# Altium project aakatz ESE 6710  Coil Interface Board.PrjPcb
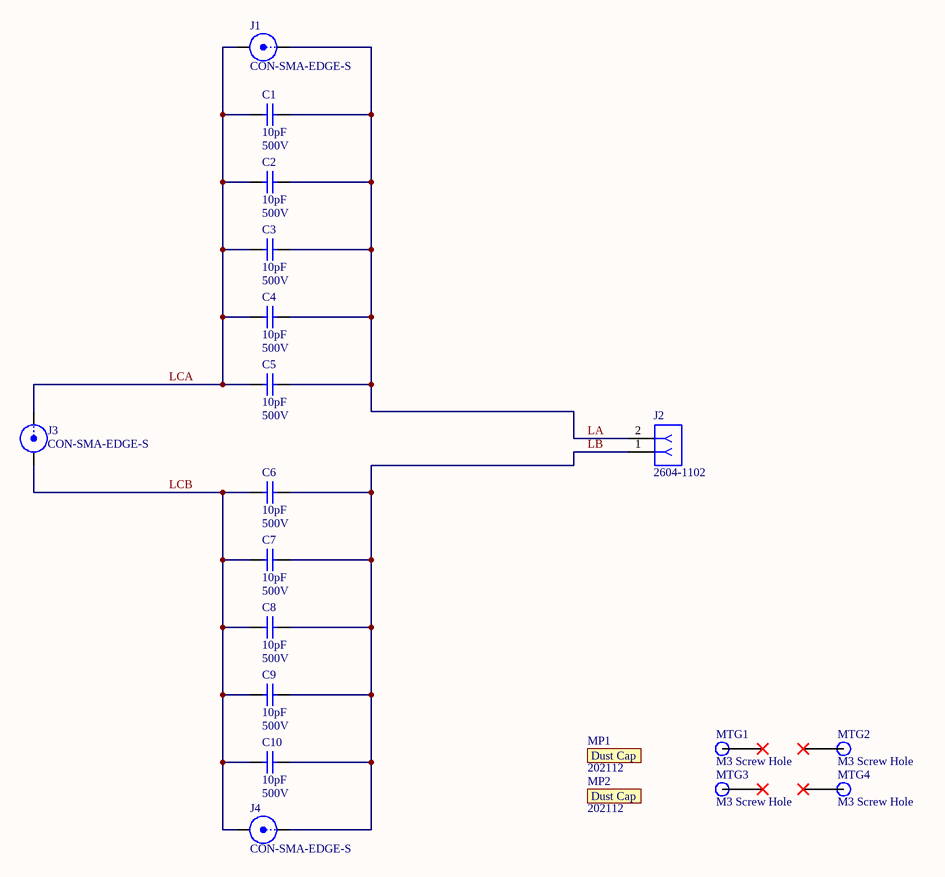
[diagram p0: Coil Interface Board.SchDoc]
Author: Andrew Katz
1 sheet, 20 parts. Net scope: global (net labels, ports and power ports of the same name join across sheets).
Board file: ESE6710 Coil Interface Board.PcbDoc

## Sheet Coil Interface Board.SchDoc
size Letter; DrawnBy: Andrew Katz; Engineer: Andrew Katz; DocumentNumber: 1; SheetNumber: 1; SheetTotal: 1

### Parts
C1  value 10pF  Voltage: 500V  [CAP_1111_ATC 800B]  (hidden comment: 800B100JT500XT1K)
C2  value 10pF  Voltage: 500V  [CAP_1111_ATC 800B]  (hidden comment: 800B100JT500XT1K)
C3  value 10pF  Voltage: 500V  [CAP_1111_ATC 800B]  (hidden comment: 800B100JT500XT1K)
C4  value 10pF  Voltage: 500V  [CAP_1111_ATC 800B]  (hidden comment: 800B100JT500XT1K)
C5  value 10pF  Voltage: 500V  [CAP_1111_ATC 800B]  (hidden comment: 800B100JT500XT1K)
C6  value 10pF  Voltage: 500V  [CAP_1111_ATC 800B]  (hidden comment: 800B100JT500XT1K)
C7  value 10pF  Voltage: 500V  [CAP_1111_ATC 800B]  (hidden comment: 800B100JT500XT1K)
C8  value 10pF  Voltage: 500V  [CAP_1111_ATC 800B]  (hidden comment: 800B100JT500XT1K)
C9  value 10pF  Voltage: 500V  [CAP_1111_ATC 800B]  (hidden comment: 800B100JT500XT1K)
C10  value 10pF  Voltage: 500V  [CAP_1111_ATC 800B]  (hidden comment: 800B100JT500XT1K)
J1  CON-SMA-EDGE-S  [FP-SMA-J-P-H-ST-EM1-MFG]
J2  2604-1102  [2604-1102_MFG]
J3  CON-SMA-EDGE-S  [FP-SMA-J-P-H-ST-EM1-MFG]
J4  CON-SMA-EDGE-S  [FP-SMA-J-P-H-ST-EM1-MFG]
MP1  202112  (mechanical)
MP2  202112  (mechanical)
MTG1  M3 Screw Hole  [M3 Screw Hole-Footprint-1]  (no BOM)
MTG2  M3 Screw Hole  [M3 Screw Hole-Footprint-1]  (no BOM)
MTG3  M3 Screw Hole  [M3 Screw Hole-Footprint-1]  (no BOM)
MTG4  M3 Screw Hole  [M3 Screw Hole-Footprint-1]  (no BOM)

### Nets
LA: C1.2 C2.2 C3.2 C4.2 C5.2 J1.1 J2.2
LB: C6.2 C7.2 C8.2 C9.2 C10.2 J2.1 J4.1
LCA: C1.1 C2.1 C3.1 C4.1 C5.1 J1.2(SHELL) J3.1
LCB: C6.1 C7.1 C8.1 C9.1 C10.1 J3.2(SHELL) J4.2(SHELL)

Not connected (* = marked no-connect by the designer): MTG1 1*; MTG2 1*; MTG3 1*; MTG4 1*

### Notes on the sheet
- Title:
- Desc:
- Size:
- Letter
- Auth:
- Sheet
- of
- www.seas.upenn.edu
- Electrical and Systems Engineering
- Proj:
- (in symbol CMP-00829-1) Dust Cap

### Library data of the parts
C1-C10 = CMP-001-00027-1: Ceramic Capacitor, Multilayer, Ceramic, 500V, 5% +Tol, 5% -Tol, C0G, 30ppm/Cel TC, 0.00001uF, Surface Mount, 1111; Min Operating Temperature: -55°C; Lifecycle Status: Production; Voltage Rating (DC): 500V; Max Operating Temperature: 125°C; Width: 2.79mm; Number of Terminals: 2; Height: 1.78mm; Mounting Technology: Surface Mount; RoHS: Compliant; Mount: SMD; Capacitor Type: Ceramic; China RoHS: Compliant; REACH SVHC: Yes; Length: 2.79mm; Case/Package: 1111; Dielectric Material: Ceramic
J1 J3 J4 = CMP-00788-5: Sma Female Connector Jack, Pcb Edge Mount Rohs Compliant: Yes; Impedance: 50Ω; Number of Contacts: 1; Frequency: 18GHz; Case/Package: SMA; Shell Material: Brass; Contact Material: Gold; RoHS: Compliant; Contact Gender: Female; Manufacturer Package Identifier: CON-SMA-EDGE-S; Height: 6.35mm; Number of Ports: 1; Pins: 1
J2 = CMP-00792-2: Pcb Terminal Block; Operating Lever; 4 MM²; Pin Spacing 5 Mm; 2-POLE; Push-in Cage Clamp®; Voltage Rating: 300V; Approvals: CB, CSA, KEMA, UL, cUL; Number of Contacts: 2; Number of Levels: 1; Wire/Cable Gauge: 12AWG; Current Rating: 20A; REACH SVHC: Yes; Pins: 2; Max Operating Temperature: 105°C; Housing Color: Grey; RoHS: Compliant; Number of Rows: 1; Lifecycle Status: Production; Contact Material: Tin; Min Operating Temperature: -60°C; Color: Grey; Height: 25.7mm
MP1 MP2 = CMP-00829-1: Amphenol RF 202112 SMA Cap for Female Connector, Brass/Gold; Connector Type: Coaxial, SMA; Body Material: Brass; Gender: Male; Body Plating: Gold; Impedance: 50Ω; Length: 8.4mm; RoHS: Compliant; Lead Free: Lead Free; Packaging: Bulk; Depth: 8mm; Weight: 2.799997g; Radiation Hardening: No; Orientation: Straight; Color: Gold; Case/Package: SMA; Lifecycle Status: Production; Exterior Housing Material: Brass
MTG1-MTG4 = CMP-00028-5: Close clearance Fit for M3 Screw Hole; PCB Mounting for M3 Screw

## Assembly variants
TX: not fitted C5 C10; alternate parts C9 -> CMP-001-00048-1, C1 -> CMP-001-00046-2, C2 -> CMP-001-00049-1, C3 -> CMP-001-00050-1, C4 -> CMP-001-00044-1, C6 -> CMP-001-00046-2, C7 -> CMP-001-00030-1, C8 -> CMP-001-00029-1
RX: not fitted C5 C10; alternate parts C4 -> CMP-0001-00021-2, C9 -> CMP-001-00044-1, C8 -> CMP-001-00045-1, C7 -> CMP-001-00030-1, C1 -> CMP-001-00046-2, C6 -> CMP-001-00046-2, C2 -> CMP-001-00047-1, C3 -> CMP-001-00044-1